# EAGLE design LB-w3-DOUBLE_OR-v03(rev4) (EAGLE 6.6.0)
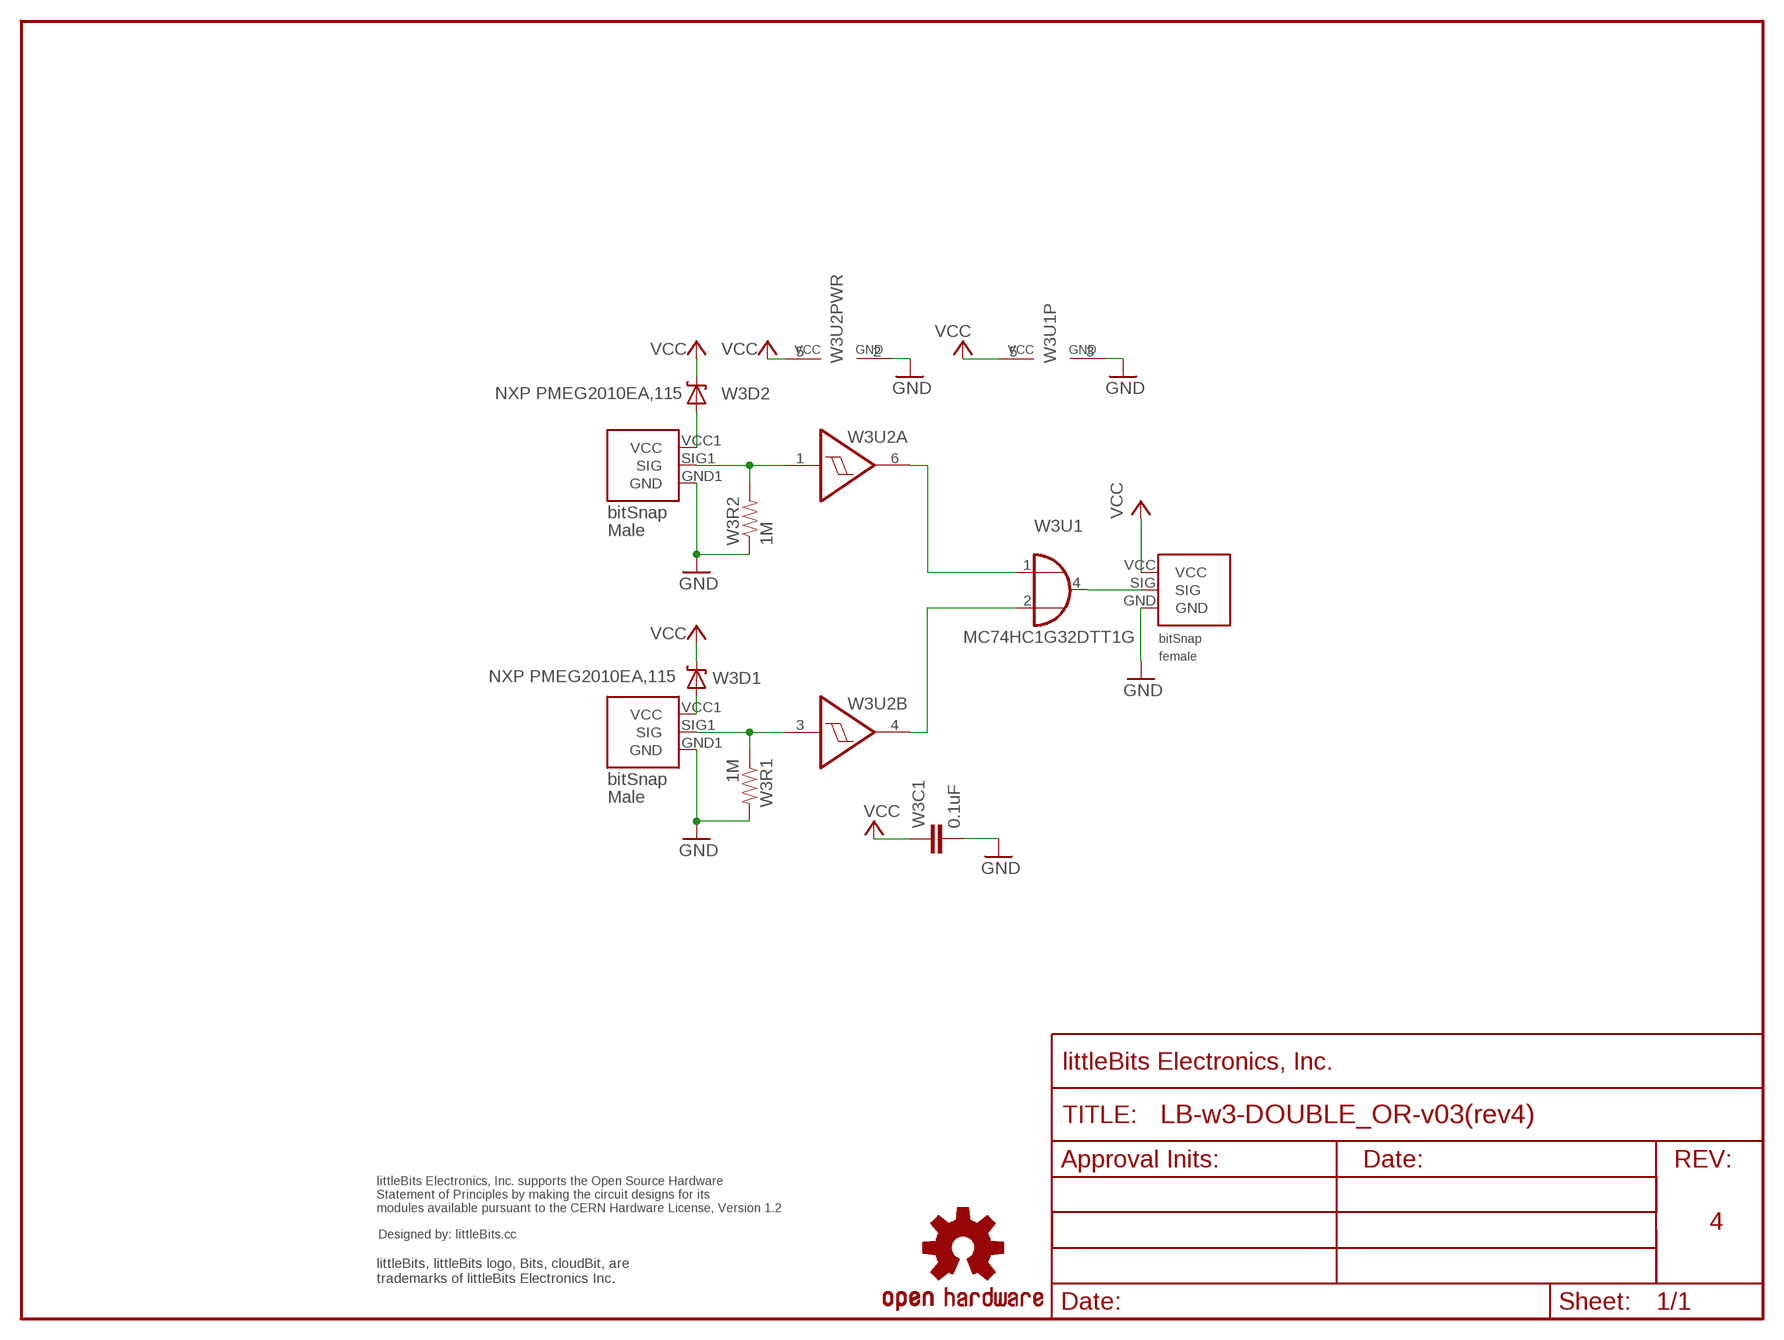
[diagram p0: schematic, sheet 1]

## Parts
U$1  OSHWCREDIT  [OSHWCREDIT]
U$2  OSHW-LOGOL  [OSHW-LOGO-L]
U$16  FRAME-LETTER-OHWOHW  [FABDWG01-OHW]
W3BSF1  BITSNAP_V03_FEMALE  [BITSNAP_V03_FEMALE]
W3BSM1  BITSNAP_V03_MALE  [BITSNAP_V03_MALE]
W3BSM2  BITSNAP_V03_MALE  [BITSNAP_V03_MALE]
W3C1  0.1uF  CAPCAP-0603  [CAP-0603]
W3D1  NXP PMEG2010EA,115  DIODE-ZENER-BZT52  [SOD-323]
W3D2  NXP PMEG2010EA,115  DIODE-ZENER-BZT52  [SOD-323]
W3R1  1M  RESISTOR0603-RES  [0603-RES]
W3R2  1M  RESISTOR0603-RES  [0603-RES]
W3U1  74AUC1G32DBV  [SOT23-5]
W3U2  SCHMITT_TRIGGER_NON_INVERTING NC7WZ17  SCHMITT_TRIGGER_NON_INVERTINGNC7WZ17  [SC70-6]

## Nets
GND: W3BSF1.GND W3BSM1.GND1(GND) W3BSM2.GND1(GND) W3C1.2 W3R1.2 W3R2.1 W3U1.3(GND) W3U2.2(PWR:GND)
N$1: W3BSM2.SIG1(SIG) W3R1.1 W3U2.3(B:I)
N$2: W3U1.1(I0) W3U2.6(A:O)
N$3: W3BSM1.VCC1(VCC) W3D2.2(A)
N$4: W3U1.2(I1) W3U2.4(B:O)
N$5: W3BSM2.VCC1(VCC) W3D1.2(A)
N$6: W3BSM1.SIG1(SIG) W3R2.2 W3U2.1(A:I)
N$9: W3BSF1.SIG W3U1.4(O)
VCC: W3BSF1.VCC W3C1.1 W3D1.1(C) W3D2.1(C) W3U1.5(VCC) W3U2.5(PWR:VCC)

## Notes on the sheet
- MC74HC1G32DTT1G
- 4

## Library data of the parts
U$1 = LITTLEBITS:OSHWCREDIT
U$2 = SparkFun_NEW:OSHW-LOGO: Open Source Hardware Logo This logo indicates the piece of hardware it is found on incorporates a OSHW license and/or adheres to the definition of open source hardware found here: http://freedomdefined.org/OSHW
U$16 = LITTLEBITS:FRAME-LETTER-OHW
W3BSF1 = bitSnap:BITSNAP_V03_FEMALE
W3BSM1 W3BSM2 = bitSnap:BITSNAP_V03_MALE
W3C1 = LITTLEBITS:CAP
W3D1 W3D2 = SparkFun:DIODE-ZENER: Zener Diode Production Part - 8199 3.4V Zener Voltage
W3R1 W3R2 = SparkFun:RESISTOR: Resistor Basic schematic elements and footprints for 0603, 1206, and PTH 1/10th watt (small) resistors.
W3U1 = 74xx-little-de:74*1G32: 2-input OR gate
W3U2 = LITTLEBITS:SCHMITT_TRIGGER_NON_INVERTING

## Board
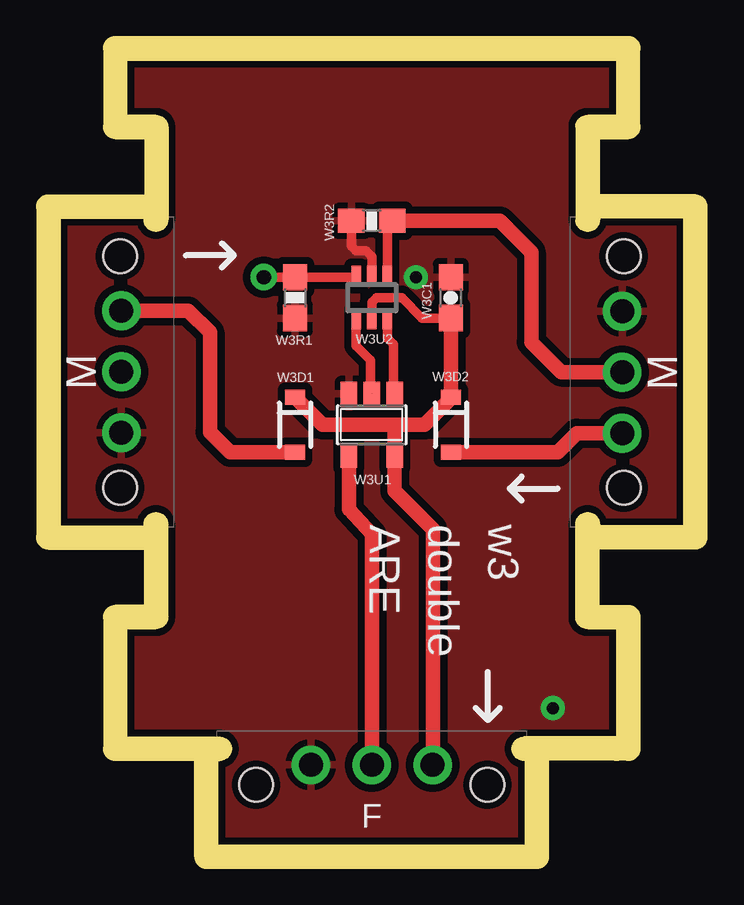
[diagram p1: board, top side]
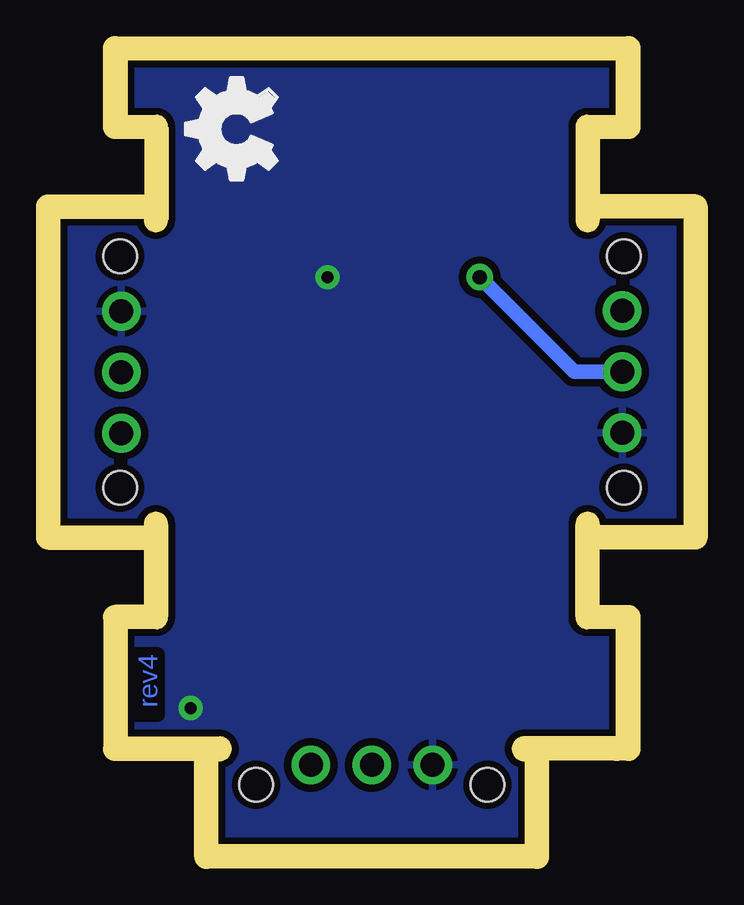
[diagram p2: board, bottom side, seen from below]

Size 26 x 32.7 mm. Coordinates in mm from the lower left corner, seen from the top.
Outline: 2.8,4.5 2.8,9 4,9 arc90 4.5,9.5 4.5,9.51
Outline: 23.2,4.5 23.2,9 22,9 arc-90 21.5,9.5 21.5,9.51
Outline: 4.5,29.91 4.5,29.9 arc90 4,30.4 2.8,30.4 2.8,32.7 23.2,32.7 23.2,30.4 22,30.4 arc90 21.5,29.9
Copper layers (1*16): Top 0.035mm / dielectric 1.5mm / Bottom 0.035mm
Design rules "default": minimum track width 8mil, minimum drill 20mil, track to track 8mil, track to pad 8mil, pad to pad 8mil, via to via 8mil, smd to smd 8mil, copper to edge 10mil, drill to drill 8mil, minimum pad ring 12mil, minimum via ring 10mil, stop-mask expansion 4mil, vias tented up to drill 25mil, thermal gap 10mil
Milling: 11 lines

### Footprints (pad centres in the part's own frame; a part is rotated, then mirrored left to right if it is on the bottom)
BITSNAP_V03_FEMALE = drill 1: GND 3.91,3.33; SIG 6.45,3.33; VCC 8.99,3.33 | hole 1.4: 1.63,2.5; 11.27,2.5
BITSNAP_V03_MALE = drill 1: GND1 8.98,2.56; SIG1 6.44,2.56; VCC1 3.9,2.56 | hole 1.4: 11.27,2.5; 1.63,2.5
CAP-0603 = smd 1.1 x 1: 1 -0.85,0; 2 0.85,0
SOD-323 = smd 0.63 x 0.83: 1 -1.15,0; 2 1.15,0
0603-RES = smd 1.1 x 1: 1 -0.85,0; 2 0.85,0
SOT23-5 = smd 0.69 x 0.99: 1 -0.95,-1.29; 2 0,-1.29; 3 0.95,-1.29; 4 0.95,1.3; 5 -0.95,1.3
SC70-6 = smd 0.4 x 0.85: 1 -0.65,-0.9; 2 0,-0.9; 3 0.65,-0.9; 4 0.65,0.9; 5 0,0.9; 6 -0.65,0.9

### Placement (x,y rotation side)
U$1  -92.3,-61.4 0 top  (outside the outline)
U$2  -31.07,-67.31 0 top  (outside the outline)
U$6  [OSHW_FILLX150_NOTEXT]  16.96,26.87 0 top
U$16  -2.2,0 0 top
W3BSF1  6.55,0 0 top
W3BSM1  26,13.25 90 top
W3BSM2  0,26.15 270 top
W3C1  16.3,22.8 90 top
W3D1  9.8,17.5 270 top
W3D2  16.3,17.5 270 top
W3R1  9.8,22.8 270 top
W3R2  13,26 0 top
W3U1  13,17.5 180 top
W3U2  13,22.8 180 top

### Tracks (layer width: path | path; a pad name or v marks a point on that pad's centre or on a via)
GND  (via drill 0.5)
  Top 0.4: W3U2.2 13,24.5 12.75,24.75 12.35,24.75 12.15,24.95 W3R2.1
  other vias: 14.85,23.65 20.55,5.7
  pour Top (isolate 0.305): 0.27,32.45 25.7,32.45 25.7,0.22 0.27,0.27
  pour Bottom (isolate 0.305): 0.27,32.45 25.7,32.45 25.7,0.22 0.27,0.27
N$1  (via drill 0.6)
  Top 0.4: W3U2.3 12.35,23.65 W3R1.1 v8.5,23.65
  Bottom 0.6: v8.5,23.65 4.56,19.71 W3BSM2.SIG1
N$2
  Top 0.4: W3U2.6 13.65,21.1 13.9,20.85 13.9,18.78
  Top 0.406: 13.9,18.78 W3U1.1
N$3
  Top 0.6: W3D2.2 20.75,16.35 21.55,17.15 W3BSM1.VCC1
N$4
  Top 0.4: W3U2.4 12.35,20.8 12.95,20.2 12.95,18.73
  Top 0.406: 12.95,18.73 W3U1.2
N$5
  Top 0.6: W3BSM2.VCC1 5.35,22.25 6.25,21.35 6.25,17.2 7.1,16.35 W3D1.2
N$6
  Top 0.4: W3U2.1 13.65,26 W3R2.2
  Top 0.6: W3R2.2 18.35,26 19.65,24.7 19.65,20.95 20.9,19.7 W3BSM1.SIG1
N$9
  Top 0.6: W3U1.4 12.05,13.97 13,12.95 W3BSF1.SIG
VCC
  Top 0.4: W3U2.5 13,22.6 13.2,22.8 14.25,22.8 15.1,21.95 W3C1.1
  Top 0.6: W3BSF1.VCC 15.55,13.15 13.95,14.75 W3U1.5 13.95,17.5 | W3D1.1 10.95,17.5 13.95,17.5 | 13.95,17.5 15.2,17.5 16.3,18.6 W3D2.1 W3C1.1

### Text on the board
Bottom: rev4
tPlace: ARE | double | w3
Milling: 1mm DIA. ROUTER PATH
Reference: LARGE